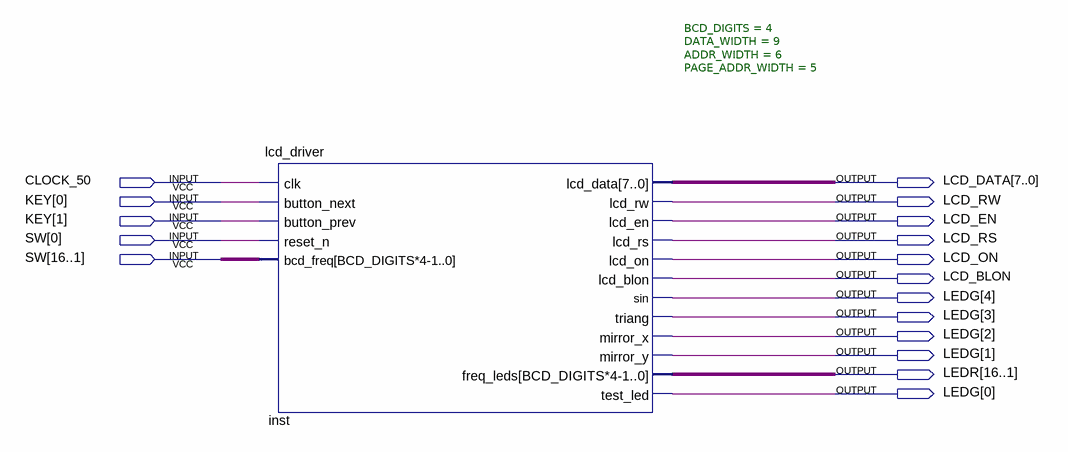
[diagram p0: schematic sheet]
// Quartus schematic LCD_module.bdf as structural Verilog: 1 symbols, 17 pins
module LCD_module (
  input  CLOCK_50,
  input  [1:0] KEY,
  input  [16:0] SW,
  output [7:0] LCD_DATA,
  output LCD_RW,
  output LCD_EN,
  output LCD_RS,
  output LCD_ON,
  output LCD_BLON,
  output [4:0] LEDG,
  output [16:1] LEDR
);

  lcd_driver #(.BCD_DIGITS(4), .DATA_WIDTH(9), .ADDR_WIDTH(6), .PAGE_ADDR_WIDTH(5)) inst (
    .clk(CLOCK_50), .button_next(KEY[0]), .button_prev(KEY[1]), .reset_n(SW[0]), .bcd_freq(SW[16:1]),
    .lcd_data(LCD_DATA), .lcd_rw(LCD_RW), .lcd_en(LCD_EN), .lcd_rs(LCD_RS), .lcd_on(LCD_ON),
    .lcd_blon(LCD_BLON), .sin(LEDG[4]), .triang(LEDG[3]), .mirror_x(LEDG[2]), .mirror_y(LEDG[1]),
    .freq_leds(LEDR), .test_led(LEDG[0]));
endmodule
